# Altium schematic sheet Sensors.SchDoc
size A3; Organization: Altium Limited; Address1: L3, 12a Rodborough Rd; Address2: Frenchs Forest; Address3: NSW; Address4: Australia 2086
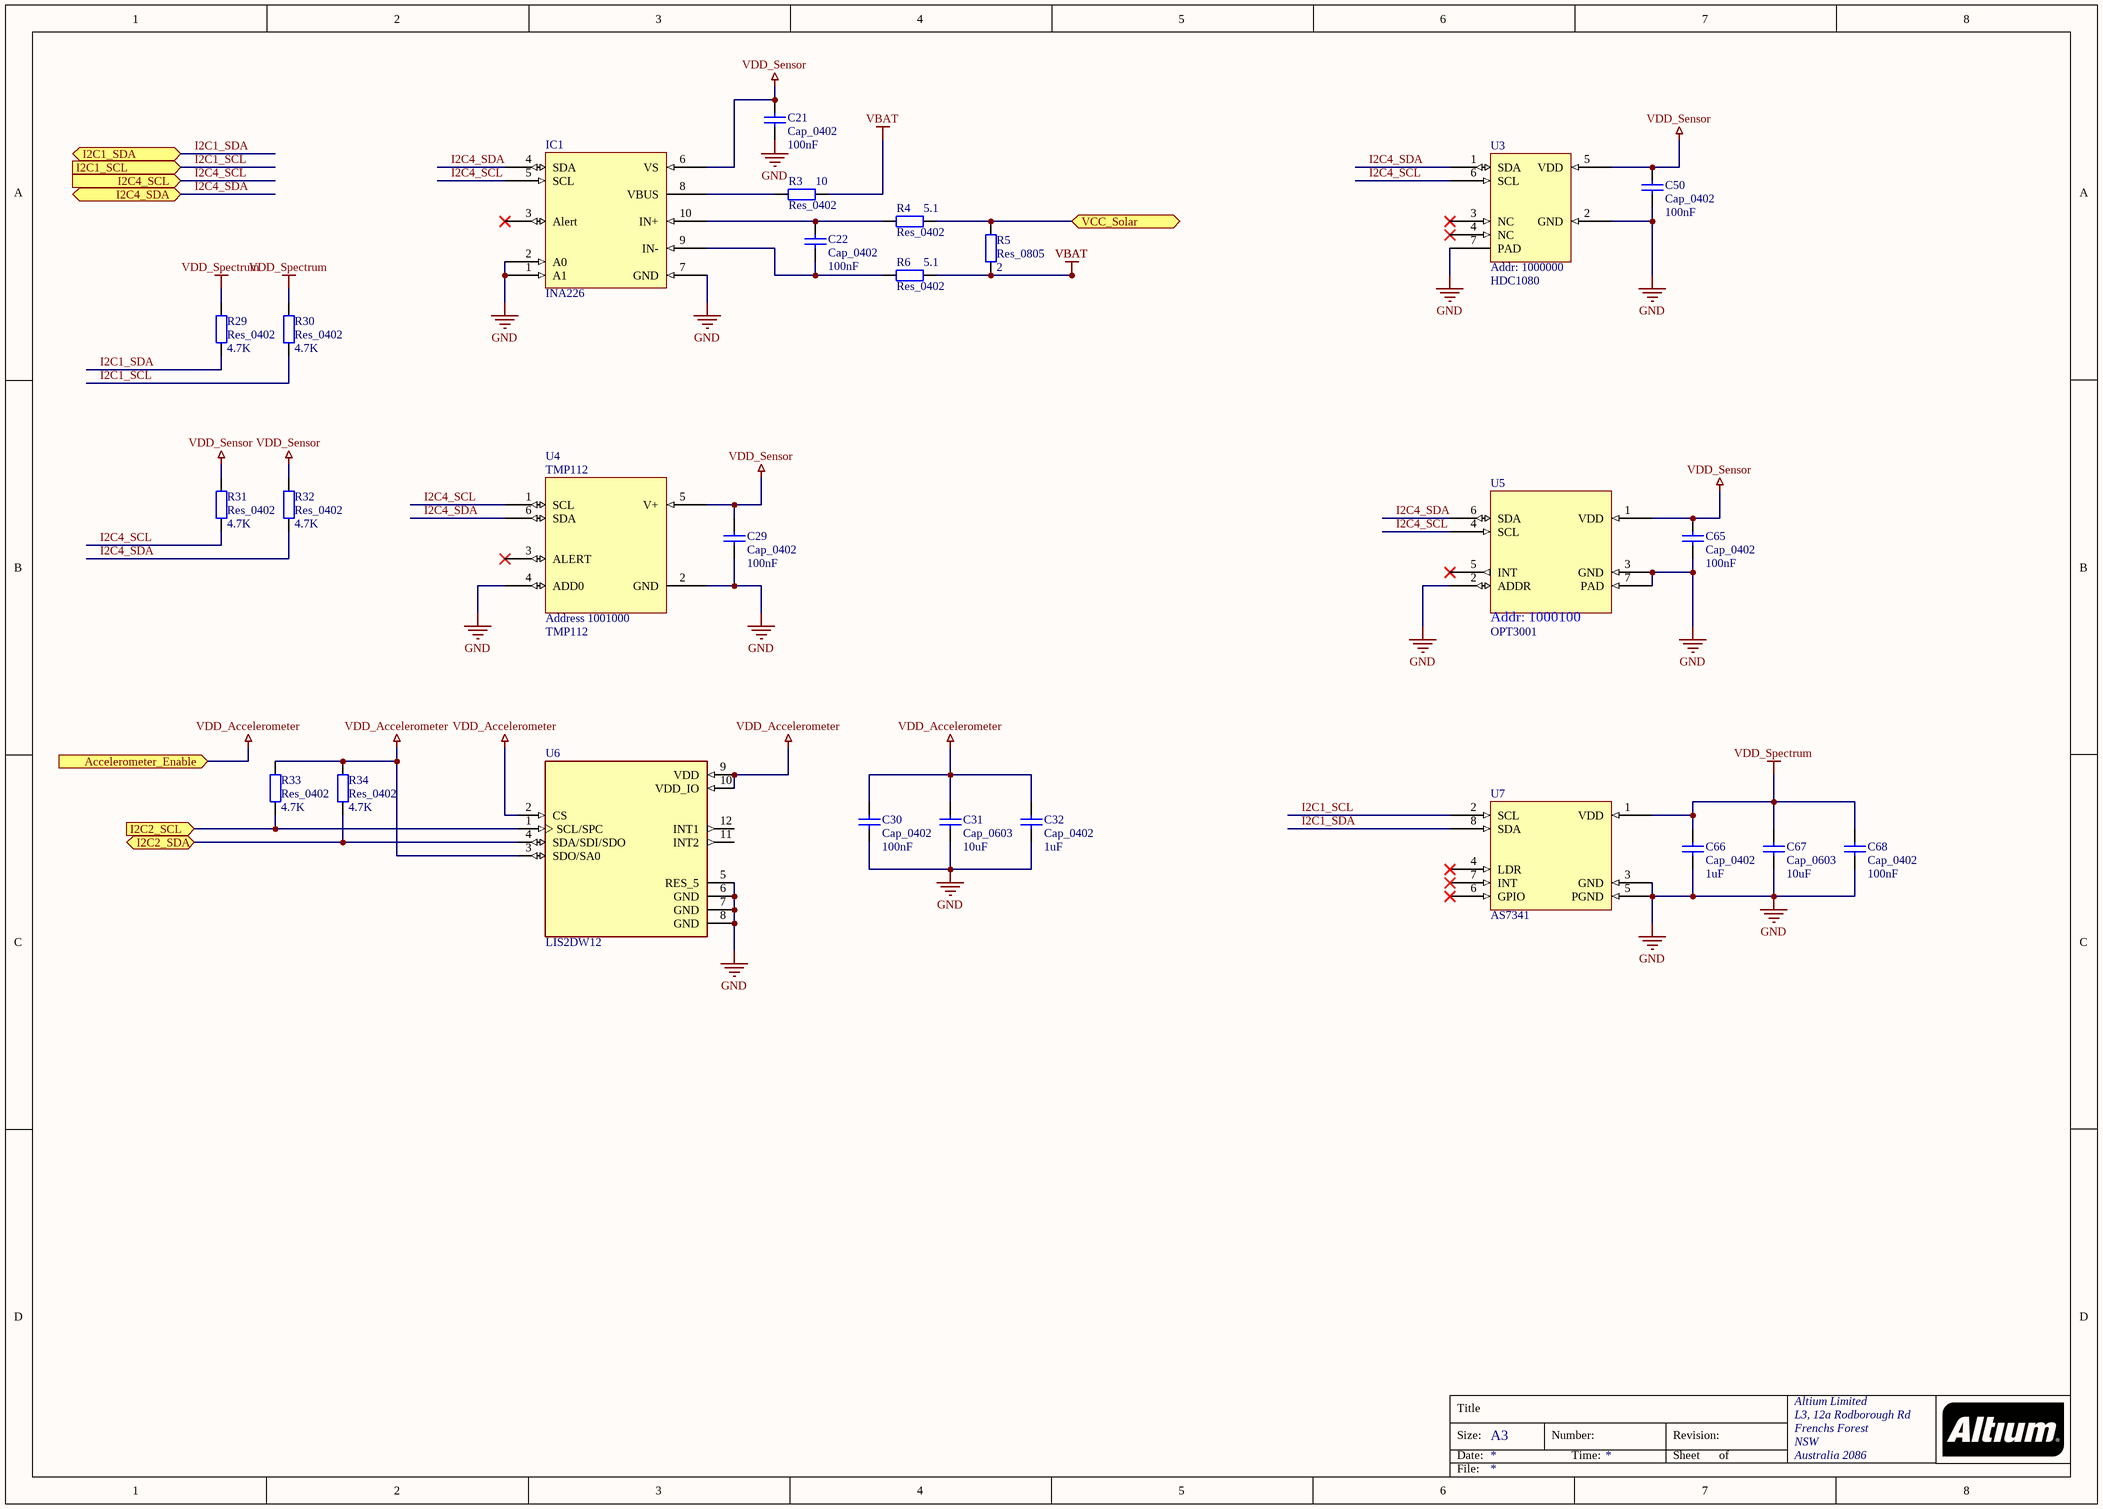
[diagram p0: Sensors.SchDoc]

## Parts
C21  Cap_0402  value 100nF  [0402]
C22  Cap_0402  value 100nF  [0402]
C29  Cap_0402  value 100nF  [0402]
C30  Cap_0402  value 100nF  [0402]
C31  Cap_0603  value 10uF  [0603]
C32  Cap_0402  value 1uF  [0402]
C50  Cap_0402  value 100nF  [0402]
C65  Cap_0402  value 100nF  [0402]
C66  Cap_0402  value 1uF  [0402]
C67  Cap_0603  value 10uF  [0603]
C68  Cap_0402  value 100nF  [0402]
IC1  INA226  [VSSOP-10]
R3  Res_0402  value 10  [0402]
R4  Res_0402  value 5.1  [0402]
R5  Res_0805  value 2  [0805]
R6  Res_0402  value 5.1  [0402]
R29  Res_0402  value 4.7K  [0402]
R30  Res_0402  value 4.7K  [0402]
R31  Res_0402  value 4.7K  [0402]
R32  Res_0402  value 4.7K  [0402]
R33  Res_0402  value 4.7K  [0402]
R34  Res_0402  value 4.7K  [0402]
U3  HDC1080  [PSON95P300X80_HS]
U4  TMP112  [SOT563 (6)]
U5  OPT3001  [USON-6]
U6  LIS2DW12  [LGA-12]
U7  AS7341  [OLGA-8]

## Ports
Accelerometer_Enable (in), I2C1_SCL (in), I2C1_SDA (bidir), I2C2_SCL (in), I2C2_SDA (bidir), I2C4_SCL (in), I2C4_SDA (bidir), VCC_Solar (bidir)

## Nets
GND: C21.1 C29.1 C30.1 C31.1 C32.1 C50.1 C65.1 C66.1 C67.1 C68.1 IC1.1(A1) IC1.2(A0) IC1.7(GND) U3.2(GND) U3.7(PAD) U4.2(GND) U4.4(ADD0) U5.2(ADDR) U5.3(GND) U5.7(PAD) U6.5(RES_5) U6.6(GND) U6.7(GND) U6.8(GND) U7.3(GND) U7.5(PGND)
VBAT: R3.2 R5.1 R6.2
VDD_Accelerometer: C30.2 C31.2 C32.2 R33.2 R34.2 U6.2(CS) U6.3(SDO/SA0) U6.9(VDD) U6.10(VDD_IO) ; port Accelerometer_Enable
VDD_Sensor: C21.2 C29.2 C50.2 C65.2 IC1.6(VS) R31.2 R32.2 U3.5(VDD) U4.5(V+) U5.1(VDD)
VDD_Spectrum: C66.2 C67.2 C68.2 R29.2 R30.2 U7.1(VDD)
I2C1_SCL: R30.1 U7.2(SCL) ; port I2C1_SCL
I2C1_SDA: R29.1 U7.8(SDA) ; port I2C1_SDA
I2C2_SCL: R33.1 U6.1(SCL/SPC) ; port I2C2_SCL
I2C2_SDA: R34.1 U6.4(SDA/SDI/SDO) ; port I2C2_SDA
I2C4_SCL: IC1.5(SCL) R31.1 U3.6(SCL) U4.1(SCL) U5.4(SCL) ; port I2C4_SCL
I2C4_SDA: IC1.4(SDA) R32.1 U3.1(SDA) U4.6(SDA) U5.6(SDA) ; port I2C4_SDA
VCC_Solar: R4.2 R5.2 ; port VCC_Solar
NetC22_1: C22.1 IC1.9(IN-) R6.1
NetC22_2: C22.2 IC1.10(IN+) R4.1
NetIC1_8: IC1.8(VBUS) R3.1

Not connected (* = marked no-connect by the designer): IC1 3(Alert)*; U3 3(NC)* 4(NC)*; U4 3(ALERT)*; U5 5(INT)*; U6 11(INT2) 12(INT1); U7 4(LDR)* 6(GPIO)* 7(INT)*

## Notes on the sheet
- Title
- Size:
- Date:
- A3
- Number:
- Time:
- Revision:
- Sheet
- of
- File:
- (in symbol HDC1080) Addr: 1000000
- (in symbol OPT3001) Addr: 1000100
- (in symbol TMP112) Address 1001000

## Library data of the parts
C21 C22 C29 C30 C32 C50 C65 C66 C68 = Cap_0402: Capacitor; Published: 8-Jun-2000; LatestRevisionDate: 17-Jul-2002; LatestRevisionNote: Re-released for DXP Platform.; PackageReference: RAD-0.3; Publisher: Altium Limited; PackageDescription: Radial Cap, Thru-Hole; 2 Leads; 0.3 in Pin Spacing
C31 C67 = Cap_0603: Capacitor; Published: 8-Jun-2000; LatestRevisionDate: 17-Jul-2002; LatestRevisionNote: Re-released for DXP Platform.; PackageReference: RAD-0.3; Publisher: Altium Limited; PackageDescription: Radial Cap, Thru-Hole; 2 Leads; 0.3 in Pin Spacing
IC1 = INA226: Bi-Directional Current and Power Monitor
R3 R4 R6 R29-R34 = Res_0402: Resistor; Published: 8-Jun-2000; LatestRevisionDate: 17-Jul-2002; LatestRevisionNote: Re-released for DXP Platform.; PackageReference: AXIAL-0.4; Publisher: Altium Limited; PackageDescription: Axial Device, Thru-Hole; 2 Leads; 0.4 in Pin Spacing
R5 = Res_0805: Resistor; Published: 8-Jun-2000; LatestRevisionDate: 17-Jul-2002; LatestRevisionNote: Re-released for DXP Platform.; PackageReference: AXIAL-0.4; Publisher: Altium Limited; PackageDescription: Axial Device, Thru-Hole; 2 Leads; 0.4 in Pin Spacing
U3 = HDC1080: Humidity Sensor
U4 = TMP112: Temperature measurement unit; Man. Part no.: TMP112AIDRLR; Digikey no.: 296-38578-1-ND; Farnell no.: 3009067
U5 = OPT3001: Lux sensor
U6 = LIS2DW12: Accelerometer X, Y, Z Axis Â±2g, 4g, 8g, 16g 0.5Hz ~ 672Hz 12-LGA _2x2_; MF: STMicroelectronics; MP: LIS2DH12; SnapEDA_Link: https://www.snapeda.com/parts/LIS2DH12/STMicroelectronics/view-part/480350/?ref=snap; Package: LGA-12 STMicroelectronics; Price: None; Value: *; Availability: Unavailable
U7 = AS7341: Spectrum Sensor